# Altium schematic sheet Funtion_V1.2.0.SchDoc
size A3
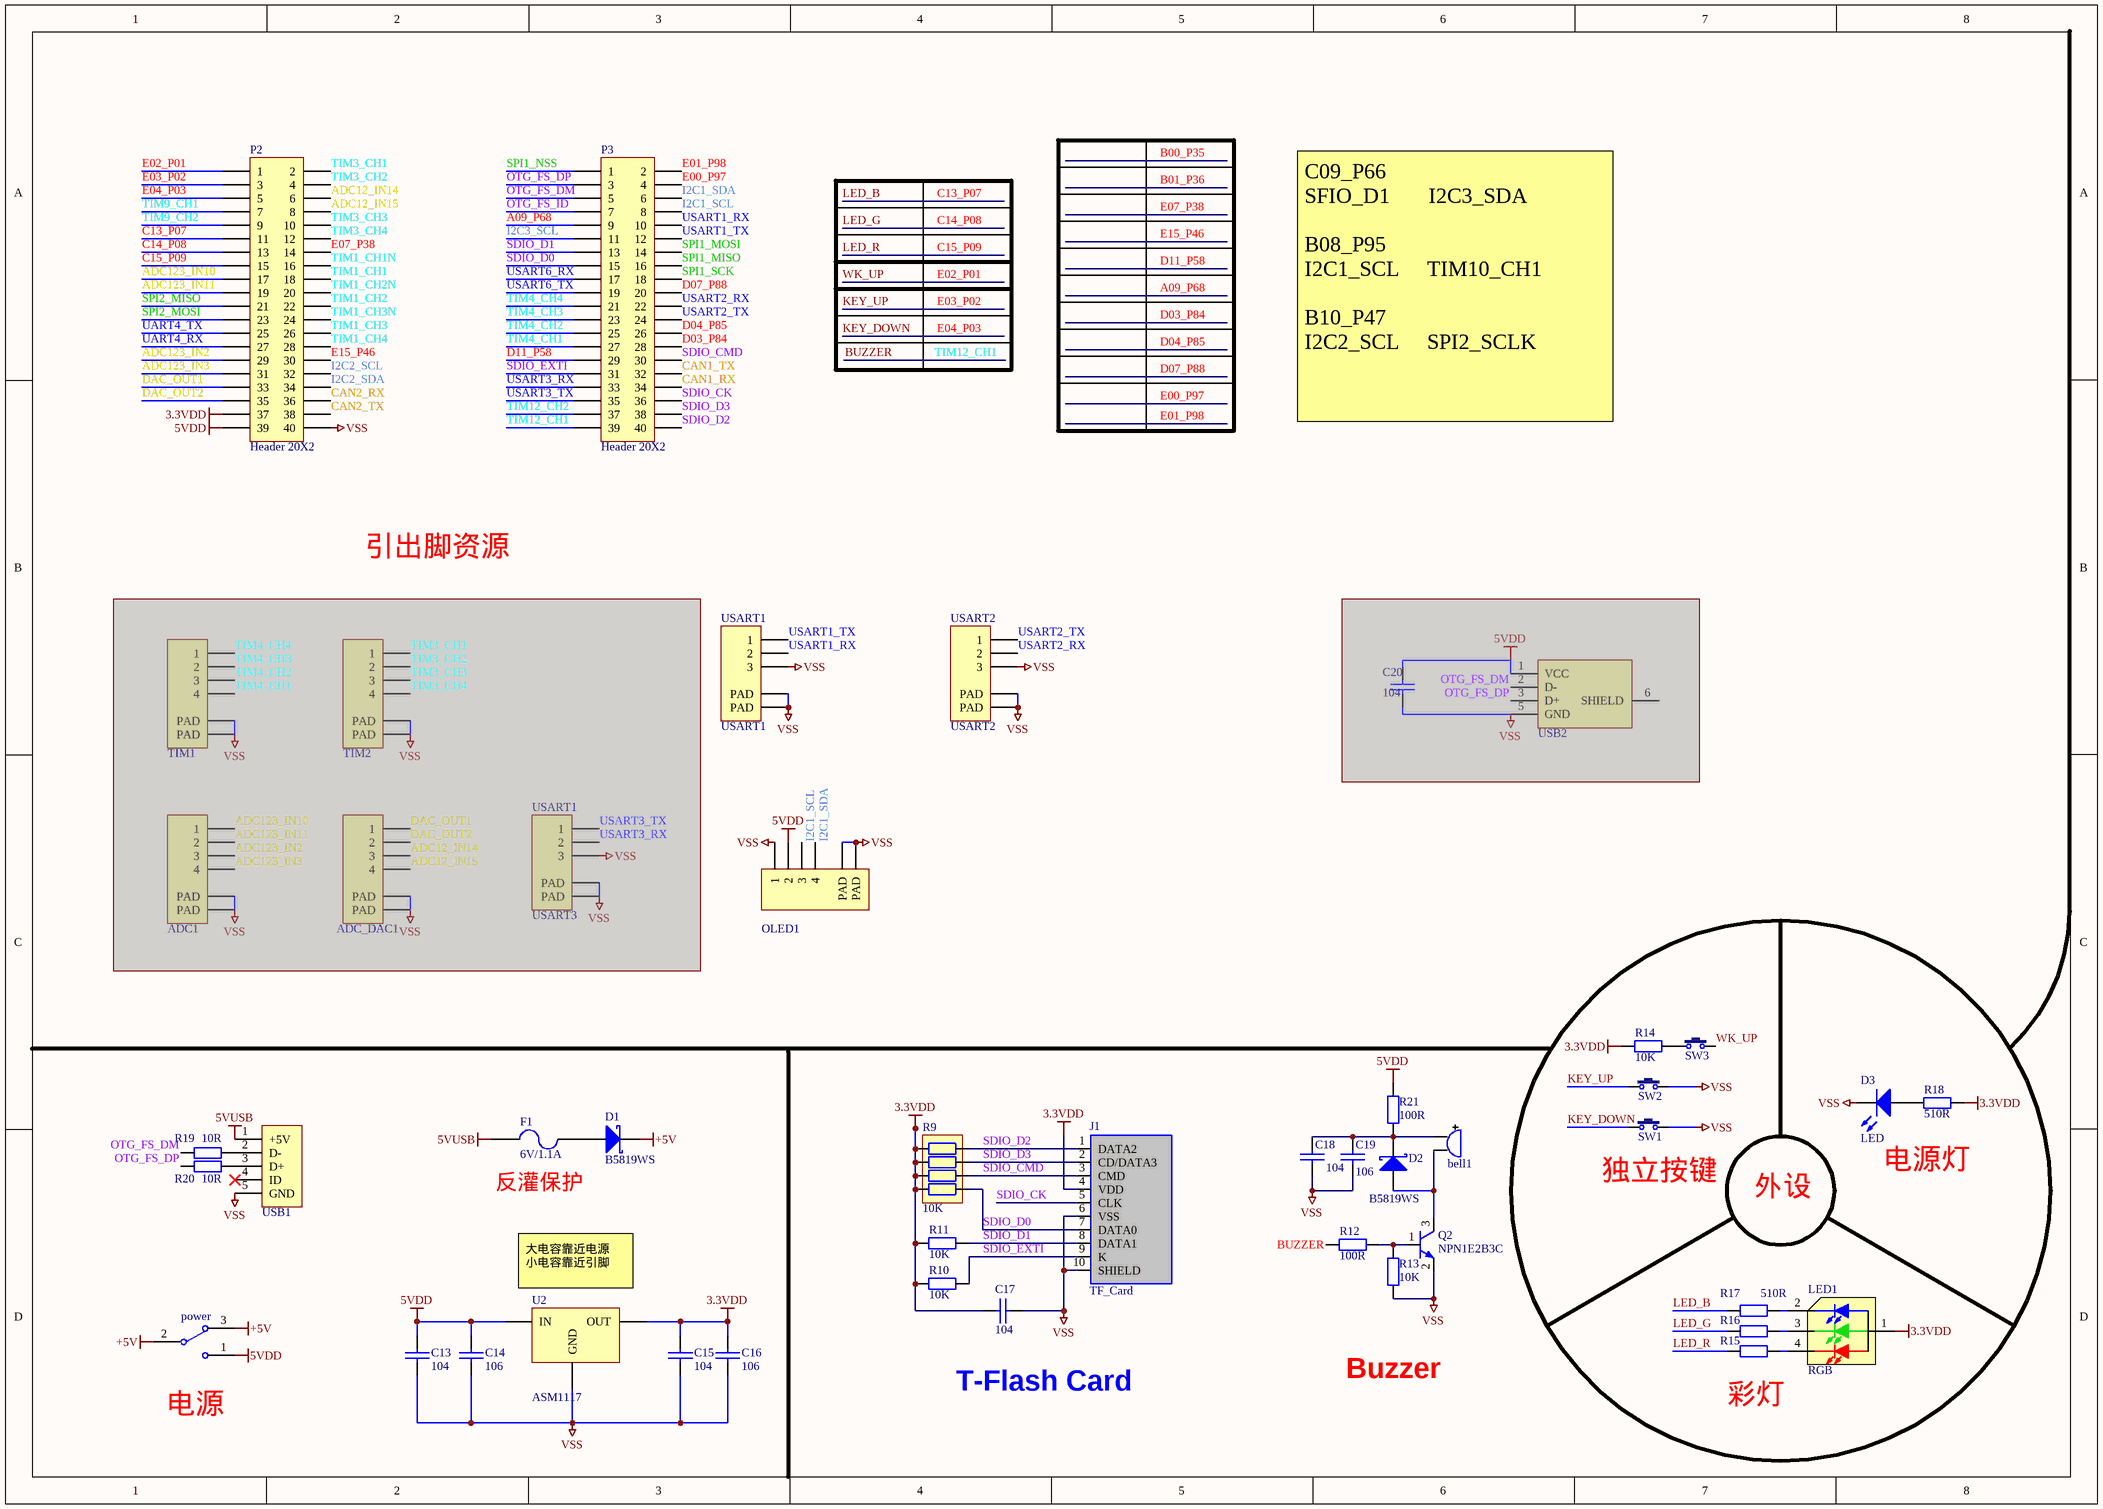
[diagram p0: Funtion_V1.2.0.SchDoc]

## Parts
(Parts that share a designator on the sheet are numbered #1, #2 ... from top to bottom, then left to right.)
ADC1  ADC  [BM04B-GHS-TBT]  (value not drawn)  (masked out: inside a compile mask, not in the netlist)
ADC_DAC1  ADC_DAC  [BM04B-GHS-TBT]  (value not drawn)  (masked out: inside a compile mask, not in the netlist)
bell1  Bell  [BEEP 5.2x5.2x2]  (value not drawn)
C13  104  [C0603]
C14  106  [C0603]
C15  104  [C0603]
C16  106  [C0603]
C17  104  [C0603]
C18  104  [C0603]
C19  106  [C0603]
C20  104  [C0603]  (masked out: inside a compile mask, not in the netlist)
D1  B5819WS  [SOD-123]
D2  B5819WS  [SOD-123]
D3  LED  [R0603]
F1  6V/1.1A  [FUSE-0805]
J1  TF_Card  [Micro SD]
LED1  RGB  [LED 3528-RGB]
OLED1  GH-4P  [BM04B-GHS-TBT]  (value not drawn)
P2  Header 20X2  [HDR1.27-LS-2X20P]
P3  Header 20X2  [HDR1.27-LS-2X20P]
power  switch-MSK-12C01-07  [MSK-12C01-07]  (value not drawn)
Q2  NPN1E2B3C  [SOT-23]
R9  10K  [RCA-8P4R-0603]
R10  10K  [R0603]
R11  10K  [R0603]
R12  100R  [R0603]
R13  10K  [R0603]
R14  10K  [R0603]
R15  510R  [R0603]  (value not drawn)
R16  510R  [R0603]  (value not drawn)
R17  510R  [R0603]
R18  510R  [R0603]
R19  10R  [R0603]
R20  10R  [R0603]
R21  100R  [R0603]
SW1  3x6x5  [TSW 3*6*4.3-S-W]  (value not drawn)
SW2  3x6x5  [TSW 3*6*4.3-S-W]  (value not drawn)
SW3  3x6x5  [TSW 3*6*4.3-S-W]  (value not drawn)
TIM1  SPI1  [BM04B-GHS-TBT]  (value not drawn)  (masked out: inside a compile mask, not in the netlist)
TIM2  SPI1  [BM04B-GHS-TBT]  (value not drawn)  (masked out: inside a compile mask, not in the netlist)
U2  ASM1117  [SOT-223]
USART1#1  USART1  [BM03B-GHS-TBT]
USART1#2  USART3  [BM03B-GHS-TBT]  (masked out: inside a compile mask, not in the netlist)
USART2  USART2  [BM03B-GHS-TBT]
USB1  USB-5P  [USB-MICRO_D]  (value not drawn)
USB2  USB  [USB-A-4+4]  (value not drawn)  (masked out: inside a compile mask, not in the netlist)

## Nets
3.3VDD: C15.2 C16.2 C17.2 J1.4(VDD) LED1.1 P2.37 R9.1 R9.2 R9.3 R9.4 R10.2 R11.2 R14.2 R18.1 U2.2(OUT)
5VDD: C13.2 C14.2 OLED1.2 P2.39 power.1 R21.1 U2.3(IN)
5VUSB: F1.1 USB1.1(+5V)
+5V: D1.2(K) power.2 power.3
VSS: C13.1 C14.1 C15.1 C16.1 C17.1 C18.1 C19.1 D3.2(K) J1.6(VSS) J1.10(SHIELD) OLED1.0(PAD) OLED1.1 OLED1.100(PAD) P2.40 Q2.2(E) R13.2 SW1.1 SW2.1 U2.1(GND) USART1#1.0(PAD) USART1#1.3 USART1#1.100(PAD) USART2.0(PAD) USART2.3 USART2.100(PAD) USB1.5(GND)
A09_P68: P3.9
ADC12_IN14: P2.6
ADC12_IN15: P2.8
ADC123_IN2: P2.29
ADC123_IN3: P2.31
ADC123_IN10: P2.17
ADC123_IN11: P2.19
BUZZER: P3.39 R12.2  [also labelled TIM12_CH1]
C13_P07: P2.11 R17.2  [also labelled LED_B]
C14_P08: P2.13 R16.2  [also labelled LED_G]
C15_P09: P2.15 R15.2  [also labelled LED_R]
CAN1_RX: P3.34
CAN1_TX: P3.32
CAN2_RX: P2.36
CAN2_TX: P2.38
D03_P84: P3.28
D04_P85: P3.26
D07_P88: P3.20
D11_P58: P3.29
DAC_OUT1: P2.33
DAC_OUT2: P2.35
E00_P97: P3.4
E01_P98: P3.2
E02_P01: P2.1 SW3.1  [also labelled WK_UP]
E03_P02: P2.3 SW2.2  [also labelled KEY_UP]
E04_P03: P2.5 SW1.2  [also labelled KEY_DOWN]
E07_P38: P2.14
E15_P46: P2.30
I2C1_SCL: OLED1.3 P3.8
I2C1_SDA: OLED1.4 P3.6
I2C2_SCL: P2.32
I2C2_SDA: P2.34
I2C3_SCL: P3.11
OTG_FS_DM: P3.5 R19.2
OTG_FS_DP: P3.3 R20.2
OTG_FS_ID: P3.7
SDIO_CK: J1.5(CLK) P3.36
SDIO_CMD: J1.3(CMD) P3.30 R9.6
SDIO_D0: J1.7(DATA0) P3.15 R9.5
SDIO_D1: J1.8(DATA1) P3.13 R11.1
SDIO_D2: J1.1(DATA2) P3.40 R9.8
SDIO_D3: J1.2(CD/DATA3) P3.38 R9.7
SDIO_EXTI: J1.9(K) P3.31 R10.1
SPI1_MISO: P3.16
SPI1_MOSI: P3.14
SPI1_NSS: P3.1
SPI1_SCK: P3.18
SPI2_MISO: P2.21
SPI2_MOSI: P2.23
TIM1_CH1: P2.18
TIM1_CH1N: P2.16
TIM1_CH2: P2.22
TIM1_CH2N: P2.20
TIM1_CH3: P2.26
TIM1_CH3N: P2.24
TIM1_CH4: P2.28
TIM3_CH1: P2.2
TIM3_CH2: P2.4
TIM3_CH3: P2.10
TIM3_CH4: P2.12
TIM4_CH1: P3.27
TIM4_CH2: P3.25
TIM4_CH3: P3.23
TIM4_CH4: P3.21
TIM9_CH1: P2.7
TIM9_CH2: P2.9
TIM12_CH2: P3.37
UART4_RX: P2.27
UART4_TX: P2.25
USART1_RX: P3.10 USART1#1.2
USART1_TX: P3.12 USART1#1.1
USART2_RX: P3.22 USART2.2
USART2_TX: P3.24 USART2.1
USART3_RX: P3.33
USART3_TX: P3.35
USART6_RX: P3.17
USART6_TX: P3.19
Netbell1_1: bell1.1(A) C18.2 C19.2 D2.2(K) R21.2
Netbell1_2: bell1.2(B) D2.1(A) Q2.3(C)
NetD1_1: D1.1(A) F1.2
NetD3_1: D3.1(A) R18.2
NetLED1_2: LED1.2 R17.1
NetLED1_3: LED1.3 R16.1
NetLED1_4: LED1.4 R15.1
NetQ2_1: Q2.1(B) R12.1 R13.1
NetR14_1: R14.1 SW3.2
NetR19_1: R19.1 USB1.2(D-)
NetR20_1: R20.1 USB1.3(D+)

Not connected (* = marked no-connect by the designer): USB1 4(ID)*

## Notes on the sheet
- C09_P66
  SFIO_D1       I2C3_SDA
  B08_P95
  I2C1_SCL     TIM10_CH1
  B10_P47
  I2C2_SCL     SPI2_SCLK
- 引出脚资源
- (near F1) 反灌保护
- (near SW1) 独立按键
- 电源灯
- 外设
- (near U2) 大电容靠近电源
  小电容靠近引脚
- T-Flash Card
- Buzzer
- (near power) 电源
- (near R15) 彩灯

## Library data of the parts
ADC1 ADC_DAC1 OLED1 TIM1 TIM2 = GH-4P: 1.0A, 50V, 1.25mm pitch connector
bell1 = Bell: Electrical Bell; Published: 24-Mar-1999; LatestRevisionDate: 17-Jul-2002; LatestRevisionNote: Re-released for DXP Platform.; PackageReference: PIN2; Publisher: Altium Limited
C13-C20 = CAP
D1 D2 = Diode Schottky
F1 = FUSE
J1 = TF_Card: TF卡座; 版权归属: 源创客; BOM名称: TF卡座; 学习资源: www.ooocke.com
LED1 = LED-RGB-A: 三基色LED 共阳; 版权归属: 源创客; BOM名称: 三基色LED; 学习资源: www.ooocke.com
P2 P3 = Header 20X2: Header, 20-Pin, Dual row; LatestRevisionDate: 17-Jul-2002; LatestRevisionNote: Re-released for DXP Platform.; Publisher: Altium Limited
R9 = R-8P4R: 贴片网络排阻; 版权归属: 源创客; BOM名称: 贴片网络排阻; 学习资源: www.ooocke.com
R10-R21 = Resistance
SW1-SW3 = TSW 3x6: 3x6轻触开关; 版权归属: 源创客; BOM名称: 3x6轻触开关; 学习资源: www.ooocke.com
USART1#1 USART1#2 USART2 = GH-3P: 1.0A, 50V, 1.25mm pitch connector
USB1 = USB-5P: 微型USB母座; 版权归属: 源创客; BOM名称: 微型USB母座; 学习资源: www.ooocke.com